# Altium schematic sheet Main.SchDoc: CONTROL BOARD
size A3; Author: Michal Karas; CompanyName: Warsaw University of Technology; DrawnBy: Michal Karas; Engineer: Michal Karas; Organization: PW; SheetNumber: 1; SheetTotal: 9
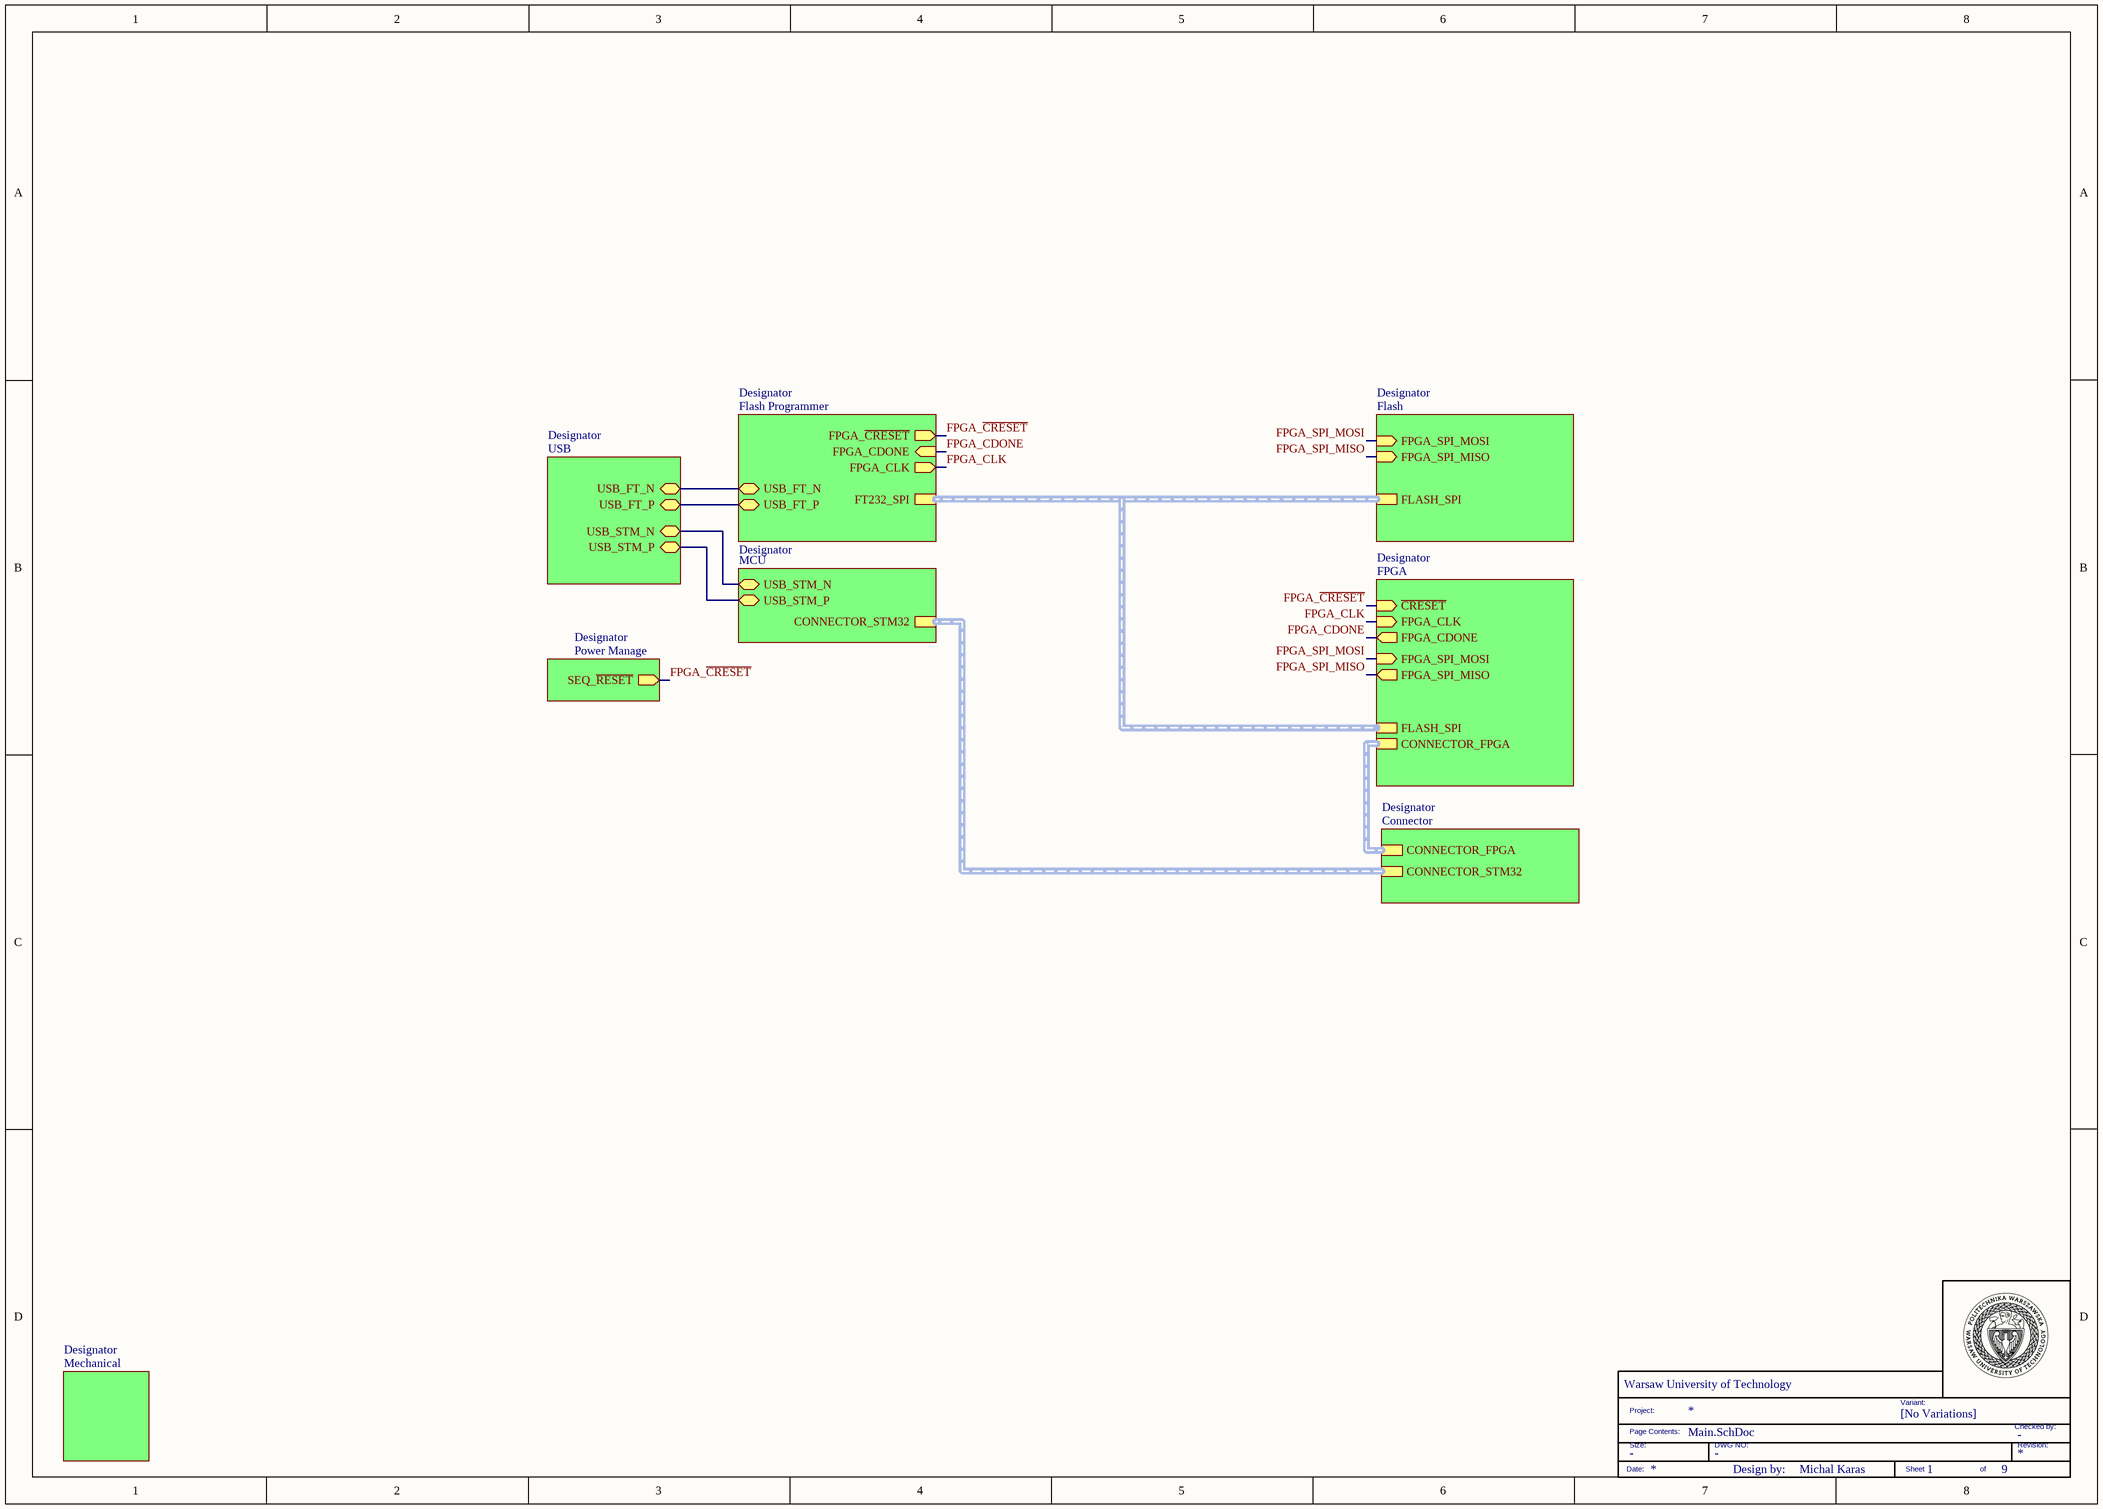
[diagram p0: Main.SchDoc]

## Parts
*  TITLE_BLOCK  (value not drawn)  (graphical)

## Sub-sheets
Designator = FPGA: ~{CRESET} (in), FPGA_CLK (in), FPGA_SPI_MOSI (in), FPGA_SPI_MISO (out), CONNECTOR_FPGA (harness CONNECTOR_FPGA), FPGA_CDONE (out), FLASH_SPI (harness FLASH_SPI)
Designator = MCU: USB_STM_N (bidir), USB_STM_P (bidir), CONNECTOR_STM32 (harness CONNECTOR_STM32)
Designator = Power Manage: SEQ_~{RESET} (out)
Designator = Mechanical: no entries
Designator = USB: USB_FT_N (bidir), USB_FT_P (bidir), USB_STM_N (bidir), USB_STM_P (bidir)
Designator = Flash: FPGA_SPI_MOSI (in), FPGA_SPI_MISO (in), FLASH_SPI (harness FLASH_SPI)
Designator = Flash Programmer: FPGA_~{CRESET} (out), FPGA_CDONE (in), FPGA_CLK (out), USB_FT_N (bidir), USB_FT_P (bidir), FT232_SPI (harness FLASH_SPI)
Designator = Connector: CONNECTOR_FPGA (harness CONNECTOR_FPGA), CONNECTOR_STM32 (harness CONNECTOR_STM32)

## Nets
FPGA_~{CRESET}: sheet Designator/~{CRESET}, sheet Designator/SEQ_~{RESET}, sheet Designator/FPGA_~{CRESET}
FPGA_CDONE: sheet Designator/FPGA_CDONE, sheet Designator/FPGA_CDONE
FPGA_CLK: sheet Designator/FPGA_CLK, sheet Designator/FPGA_CLK
FPGA_SPI_MISO: sheet Designator/FPGA_SPI_MISO, sheet Designator/FPGA_SPI_MISO
FPGA_SPI_MOSI: sheet Designator/FPGA_SPI_MOSI, sheet Designator/FPGA_SPI_MOSI
(unnamed): sheet Designator/USB_STM_N, sheet Designator/USB_STM_N
(unnamed): sheet Designator/USB_STM_P, sheet Designator/USB_STM_P
(unnamed): sheet Designator/USB_FT_N, sheet Designator/USB_FT_N
(unnamed): sheet Designator/USB_FT_P, sheet Designator/USB_FT_P

## Buses and harness runs
harness sheet Designator/FLASH_SPI = sheet Designator/FT232_SPI

## Notes on the sheet
- (in symbol CMP-003-000005-7) Variant:; Project:; [No Variations]; Checked by:; Page Contents:; Size:; DWG NO:; Revision:; Date:; Design by:; Sheet; of

## Library data of the parts
* = CMP-003-000005-7: TITLEBLOCK; DWG NO: -; Size: -; Checked by: -; Design Item ID: TITLE_BLOCK; Source: TITLEBLOCK.SchLib